# Altium schematic sheet Sheet1.SchDoc
size A4
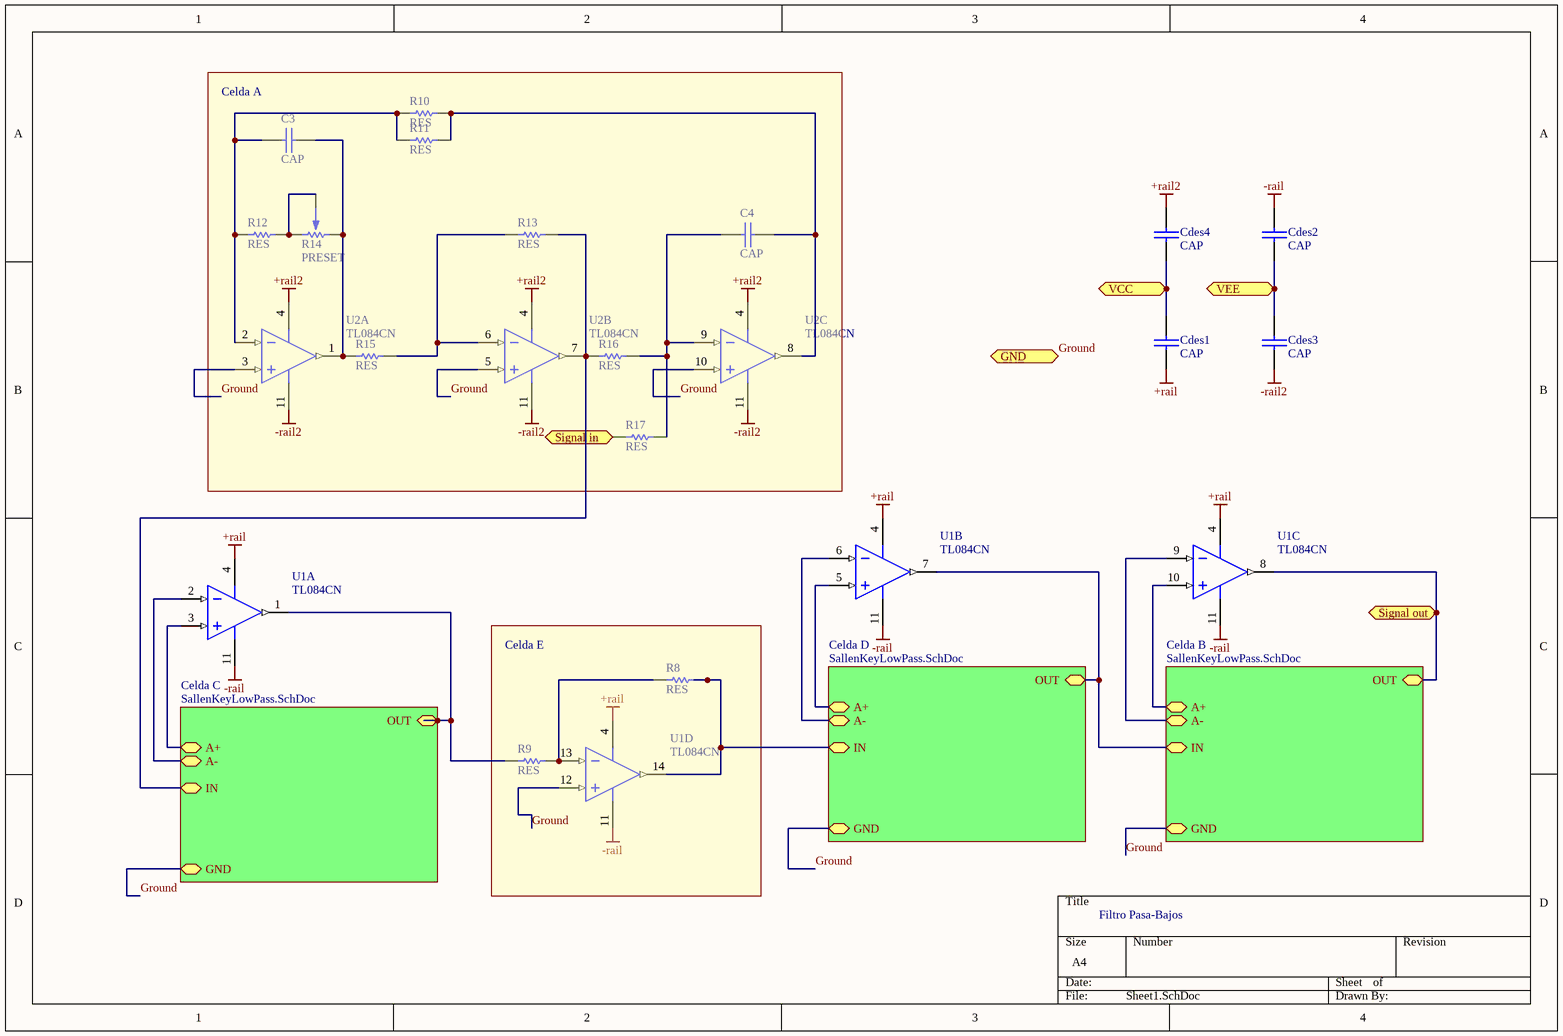
[diagram p0: Sheet1.SchDoc]

## Parts
C3  CAP  [CAP100]
C4  CAP  [CAP100]
Cdes1  CAP  [CAP100]
Cdes2  CAP  [CAP100]
Cdes3  CAP  [CAP100]
Cdes4  CAP  [CAP100]
R8  RES  [RES300]
R9  RES  [RES300]
R10  RES  [RES300]
R11  RES  [RES300]
R12  RES  [RES300]
R13  RES  [RES300]
R14  PRESET  [PRESET V]
R15  RES  [RES300]
R16  RES  [RES300]
R17  RES  [RES300]
U1  TL084CN  [TI-N14]  (parts A,B,C,D of 4)
U2  TL084CN  [TI-N14]  (parts A,B,C of 4)

## Blocks framed on the sheet
Celda A: C3 C4 R10-R17 U2
Celda E: R8 R9 U1

## Sub-sheets
Celda B = SallenKeyLowPass.SchDoc: IN, GND, OUT, A+, A-
Celda C = SallenKeyLowPass.SchDoc: IN, GND, OUT, A+, A-
Celda D = SallenKeyLowPass.SchDoc: IN, GND, OUT, A+, A-

## Ports
GND, Signal in, Signal out, VCC, VEE

## Nets
+rail: Cdes1.2 U1.4(VCC+)
+rail2: Cdes4.1 U2.4(VCC+)
-rail: Cdes2.1 U1.11(VCC-)
-rail2: Cdes3.2 U2.11(VCC-)
Ground: U1.12(IN4+) U2.3(IN1+) U2.5(IN2+) U2.10(IN3+) ; port GND, sheet Celda C/GND, sheet Celda D/GND, sheet Celda B/GND
Signal in: R17.1 ; port Signal in
Signal out: U1.8(OUT3) ; port Signal out, sheet Celda B/OUT
VCC: Cdes1.1 Cdes4.2 ; port VCC
VEE: Cdes2.2 Cdes3.1 ; port VEE
NetC3_1: C3.1 R10.1 R11.1 R12.1 U2.2(IN1-)
NetC3_2: C3.2 R14.3 R15.1 U2.1(OUT1)
NetC4_1: C4.1 R16.2 R17.2 U2.9(IN3-)
NetC4_2: C4.2 R10.2 R11.2 U2.8(OUT3)
NetR8_1: R8.1 R9.2 U1.13(IN4-)
NetR8_2: R8.2 U1.14(OUT4) ; sheet Celda D/IN
NetR9_1: R9.1 U1.1(OUT1) ; sheet Celda C/OUT
NetR12_2: R12.2 R14.1 R14.2
NetR13_1: R13.1 R15.2 U2.6(IN2-)
NetR13_2: R13.2 R16.1 U2.7(OUT2) ; sheet Celda C/IN
NetU1_2: U1.2(IN1-) ; sheet Celda C/A-
NetU1_3: U1.3(IN1+) ; sheet Celda C/A+
NetU1_5: U1.5(IN2+) ; sheet Celda D/A+
NetU1_6: U1.6(IN2-) ; sheet Celda D/A-
NetU1_7: U1.7(OUT2) ; sheet Celda D/OUT, sheet Celda B/IN
NetU1_9: U1.9(IN3-) ; sheet Celda B/A-
NetU1_10: U1.10(IN3+) ; sheet Celda B/A+

## Notes on the sheet
- Filtro Pasa-Bajos

## Library data of the parts
U1 U2 = TL084CN: JFET-Input Operational Amplifier, 7 to 36 V, 0 to 70 degC, 14-pin DIP (N14), Pb-Free (RoHS); Manufacturer: Texas Instruments; CMRR(Min)(dB): 70; GBW(Typ)(MHz): 3; IIB(Max)(pA): 400; Iq per channel(Max)(mA): 2.8; Number of Channels: 4; Offset Drift(Typ)(uV/C): 18; Rating: Catalog; Slew Rate(Typ)(V/us): 13; Sub Family: General Purpose Amplifier, High Supply Voltage Amplifier (>=30V); Total Supply Voltage(Max)(+5V is 5, +/-5V is 10): 36; Total Supply Voltage(Min)(+5V is 5, +/-5V is 10): 7; Vio (25C)(Max)(mV): 15; DatasheetVersion: SLOS081G; PackageVersion: 4040049/E, 12/2002; PackageReference: N14; PackageDescription: 14-Pin Plastic In-Line, Body 19.305 x 6.35 mm, Pitch 2.54 mm; Supplier 1: Digi-Key; Supplier Part Number 1: 296-1784-5-ND; Supplier 2: Farnell; Supplier Part Number 2: 1106020; Supplier 3: Newark; Supplier Part Number 3: 08F9374; Supplier 4: Mouser; Supplier Part Number 4: 595-TL084CN; Eco-Plan: Pb-Free (RoHS); Vn at 1kHz(Typ)(nV/rtHz): 18; Mounting Technology: Through Hole; Code_JEDEC: MS-001; PartNumber: TL084CN; ComponentLink1Description: Manufacturer URL; ComponentLink1URL: http://www.ti.com/; ComponentLink2Description: Datasheet; ComponentLink2URL: http://www.ti.com/lit/ds/symlink/tl084.pdf; ComponentLink3Description: Package Specification; ComponentLink3URL: http://www.ti.com/lit/ml/mpdi002c/mpdi002c.pdf